# Altium schematic sheet LLaveAnalogica.SchDoc
size A4
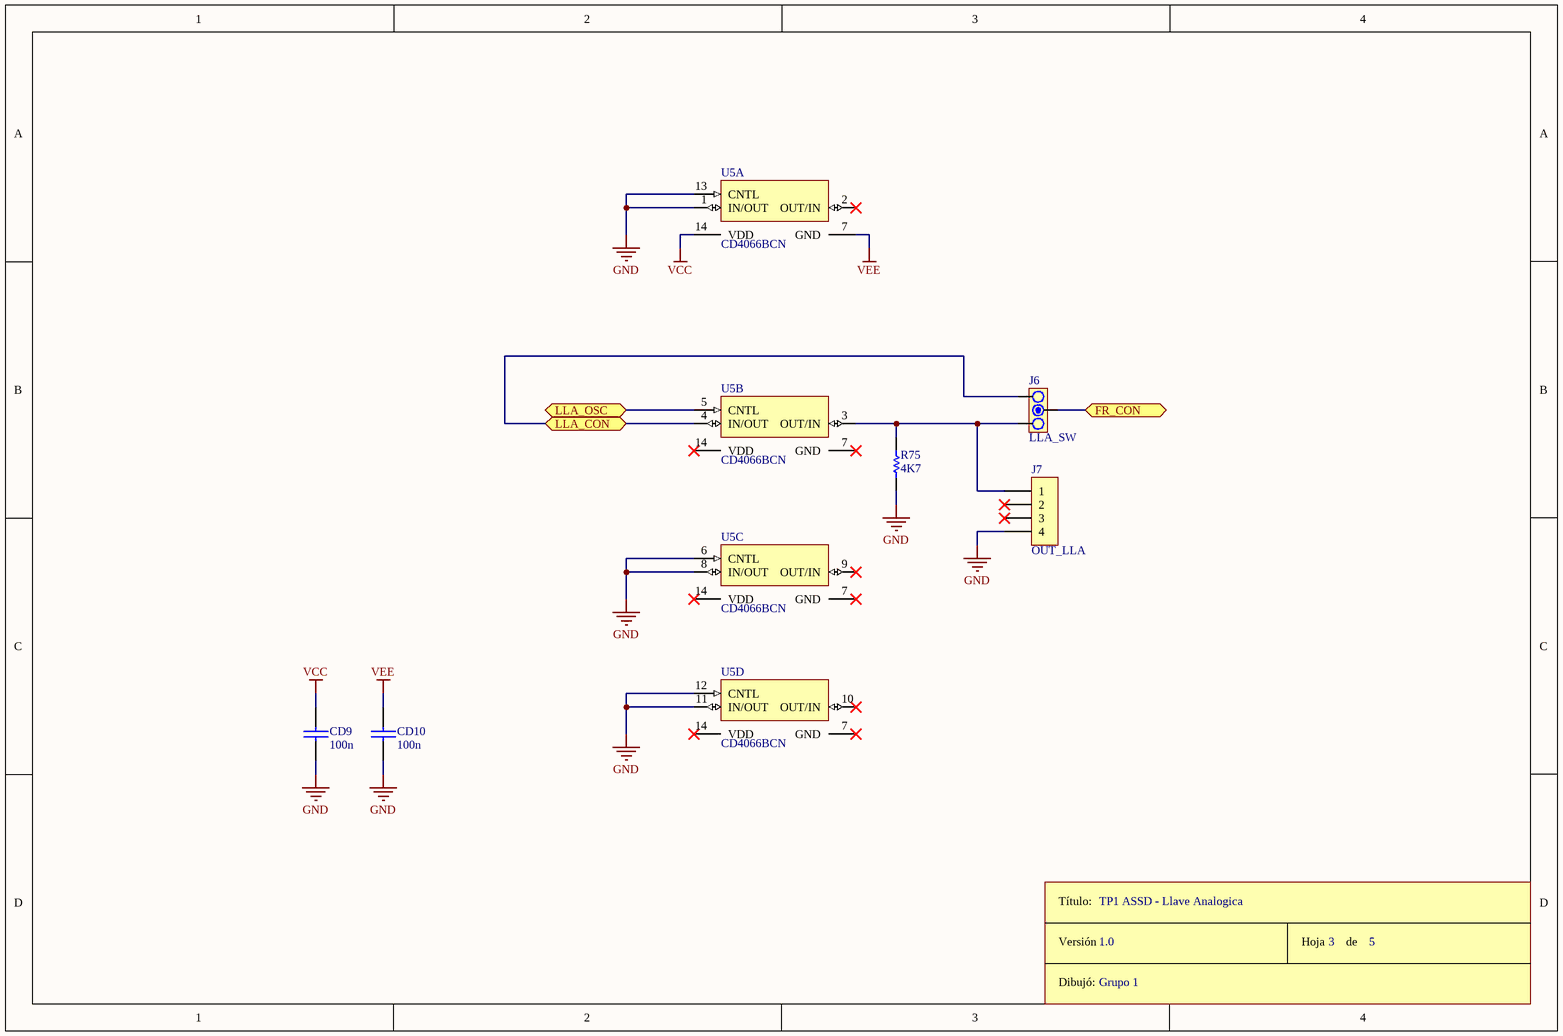
[diagram p0: LLaveAnalogica.SchDoc]

## Parts
CD9  100n  [CAP100]
CD10  100n  [CAP100]
J6  LLA_SW  [JUMPER3]
J7  OUT_LLA  [SIP4]
R75  4K7  [RES400]
ROT3  Rótulo  (value not drawn)
U5  CD4066BCN  [N14A]  (parts A,B,C,D of 4)

## Ports
FR_CON, LLA_CON, LLA_OSC

## Nets
GND: CD9.2 CD10.1 CD10.2 J7.4 R75.1 U5.1(IN/OUT) U5.6(CNTL) U5.7(GND) U5.8(IN/OUT) U5.11(IN/OUT) U5.12(CNTL) U5.13(CNTL)  [also labelled VEE]
VCC: CD9.1 U5.14(VDD)  [also labelled VDD]
FR_CON: J6.2 ; port FR_CON
LLA_CON: J6.3 U5.4(IN/OUT) ; port LLA_CON
LLA_OSC: U5.5(CNTL) ; port LLA_OSC
NetJ6_1: J6.1 J7.1 R75.2 U5.3(OUT/IN)

Not connected (* = marked no-connect by the designer): J7 2* 3*; U5 2(OUT/IN)* 9(OUT/IN)* 10(OUT/IN)*

## Notes on the sheet
- TP1 ASSD - Llave Analogica
- 1.0
- Grupo 1
- 3
- 5
- (in symbol Rótulo) Título:; Versión; Hoja       de; Dibujó:

## Library data of the parts
CD9 CD10 = CAP
J6 = JUMPER3
J7 = CON4
R75 = RES
U5 = CD4066BCN: Quad Bilateral Switch; Published: 17-Jul-2002; LatestRevisionDate: 29-May-2009; LatestRevisionNote: Component Body Added.; DatasheetVersion: Dec-1998; PackageVersion: 2000; PackageReference: N14A; Publisher: Altium Limited; PackageDescription: DIP, 14-Pin, Row Spacing 7.62 mm, Pitch 2.54 mm; ComponentLink1Description: Manufacturer Link; ComponentLink1URL: http://www.fairchildsemi.com/; ComponentLink2Description: Datasheet; ComponentLink2URL: http://www.fairchildsemi.com/ds/CD%2FCD4069UBC.pdf